# Altium schematic sheet Sheet_电磁杆.schdoc
size 175 x 91 mm
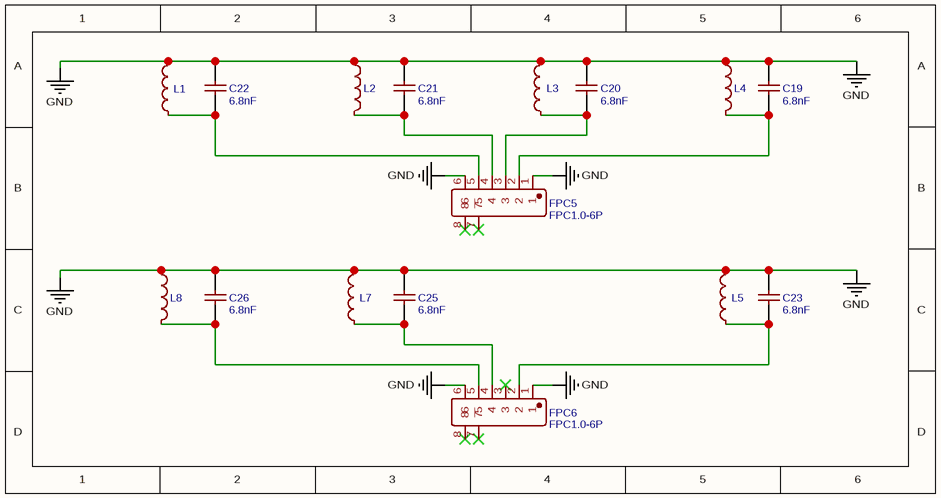
[diagram p0: Sheet_电磁杆.schdoc]

## Parts
C19  6.8nF  [CAP-2.5*6.5*7.2]
C20  6.8nF  [CAP-2.5*6.5*7.2]
C21  6.8nF  [CAP-2.5*6.5*7.2]
C22  6.8nF  [CAP-2.5*6.5*7.2]
C23  6.8nF  [CAP-2.5*6.5*7.2]
C25  6.8nF  [CAP-2.5*6.5*7.2]
C26  6.8nF  [CAP-2.5*6.5*7.2]
FPC5  FPC1.0-6P  [FPC-SMD_8P-P1.00_FPC1.0-8P-SJ]
FPC6  FPC1.0-6P  [FPC-SMD_8P-P1.00_FPC1.0-8P-SJ]
L1  10mH工字电感  [10MH工字电感]  (value not drawn)
L2  10mH工字电感  [10MH工字电感]  (value not drawn)
L3  10mH工字电感  [10MH工字电感]  (value not drawn)
L4  10mH工字电感  [10MH工字电感]  (value not drawn)
L5  10mH工字电感  [10MH工字电感]  (value not drawn)
L7  10mH工字电感  [10MH工字电感]  (value not drawn)
L8  10mH工字电感  [10MH工字电感]  (value not drawn)

## Nets
GND: C19.2 C20.2 C21.2 C22.2 C23.2 C25.2 C26.2 FPC5.1 FPC5.6 FPC6.1 FPC6.6 L1.2 L2.1 L3.2 L4.1 L5.2 L7.2 L8.1
NetC19_1: C19.1 FPC5.2 L4.2
NetC20_1: C20.1 FPC5.3 L3.1
NetC21_1: C21.1 FPC5.4 L2.2
NetC22_1: C22.1 FPC5.5 L1.1
NetC23_1: C23.1 FPC6.2 L5.1
NetC25_1: C25.1 FPC6.4 L7.1
NetC26_1: C26.1 FPC6.5 L8.2

Not connected (* = marked no-connect by the designer): FPC5 7* 8*; FPC6 3* 7* 8*

## Library data of the parts
C19-C23 C25 C26 = 6.8nF: Manufacturer: 汤姆逊 TPC; Manufacturer Part: 682J100V; nameAlias: Capacitance; Package Display: No; spicePre: C; spiceSymbolName: 校正电容
FPC5 FPC6 = FPC1.0-6P: Manufacturer: Ckmtw; Manufacturer Part: FPC1.0-8P; Contributor: zjw101016; Supplier: LCSC; Supplier Part: C132510; JLCPCB Part Class: Extended Part; spicePre: F; spiceSymbolName: FPC1.0-6P
L1-L5 L7 L8 = 10mH工字电感: Contributor: H_Z_Y; Package Display: No; spicePre: L; spiceSymbolName: 10mH工字电感